# EAGLE design lab2_task1 (EAGLE 6.5.0)
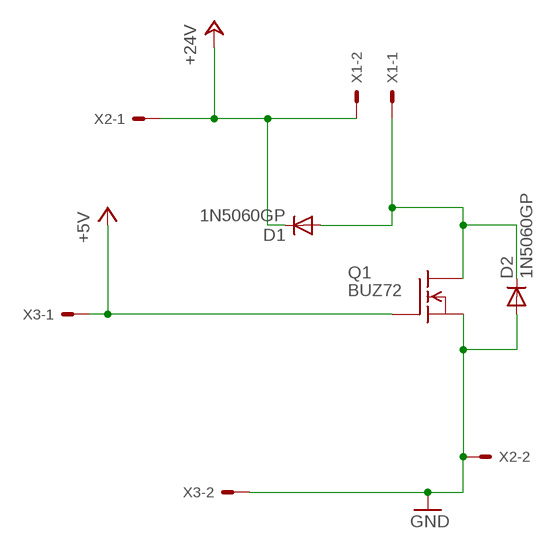
[diagram p0: schematic, sheet 1]

## Parts
D1  1N5060GP  [DO15-12]
D2  1N5060GP  [DO15-12]
Q1  BUZ72  [TO220]
X1  KK-156-2  [KK-156-2]
X2  KK-156-2  [KK-156-2]
X3  KK-156-2  [KK-156-2]

## Nets
+5V: Q1.1(G) X3.1
+24V: D1.C X1.2 X2.1
GND: D2.A Q1.3(S) X2.2 X3.2
N$1: D1.A D2.C Q1.2(D) X1.1

## Library data of the parts
D1 D2 = diode:1N5060GP: DIODE controlled avalanche rectifier
Q1 = transistor-fet:BUZ72: N-Channel Enhancement MOSFET 100V; 10A; 0,2Ohm
X1-X3 = con-molex:KK-156-2: KK 156 HEADER Source: http://www.molex.com/pdm_docs/sd/026604100_sd.pdf; OC_FARNELL: unknown; OC_NEWARK: unknown

## Board
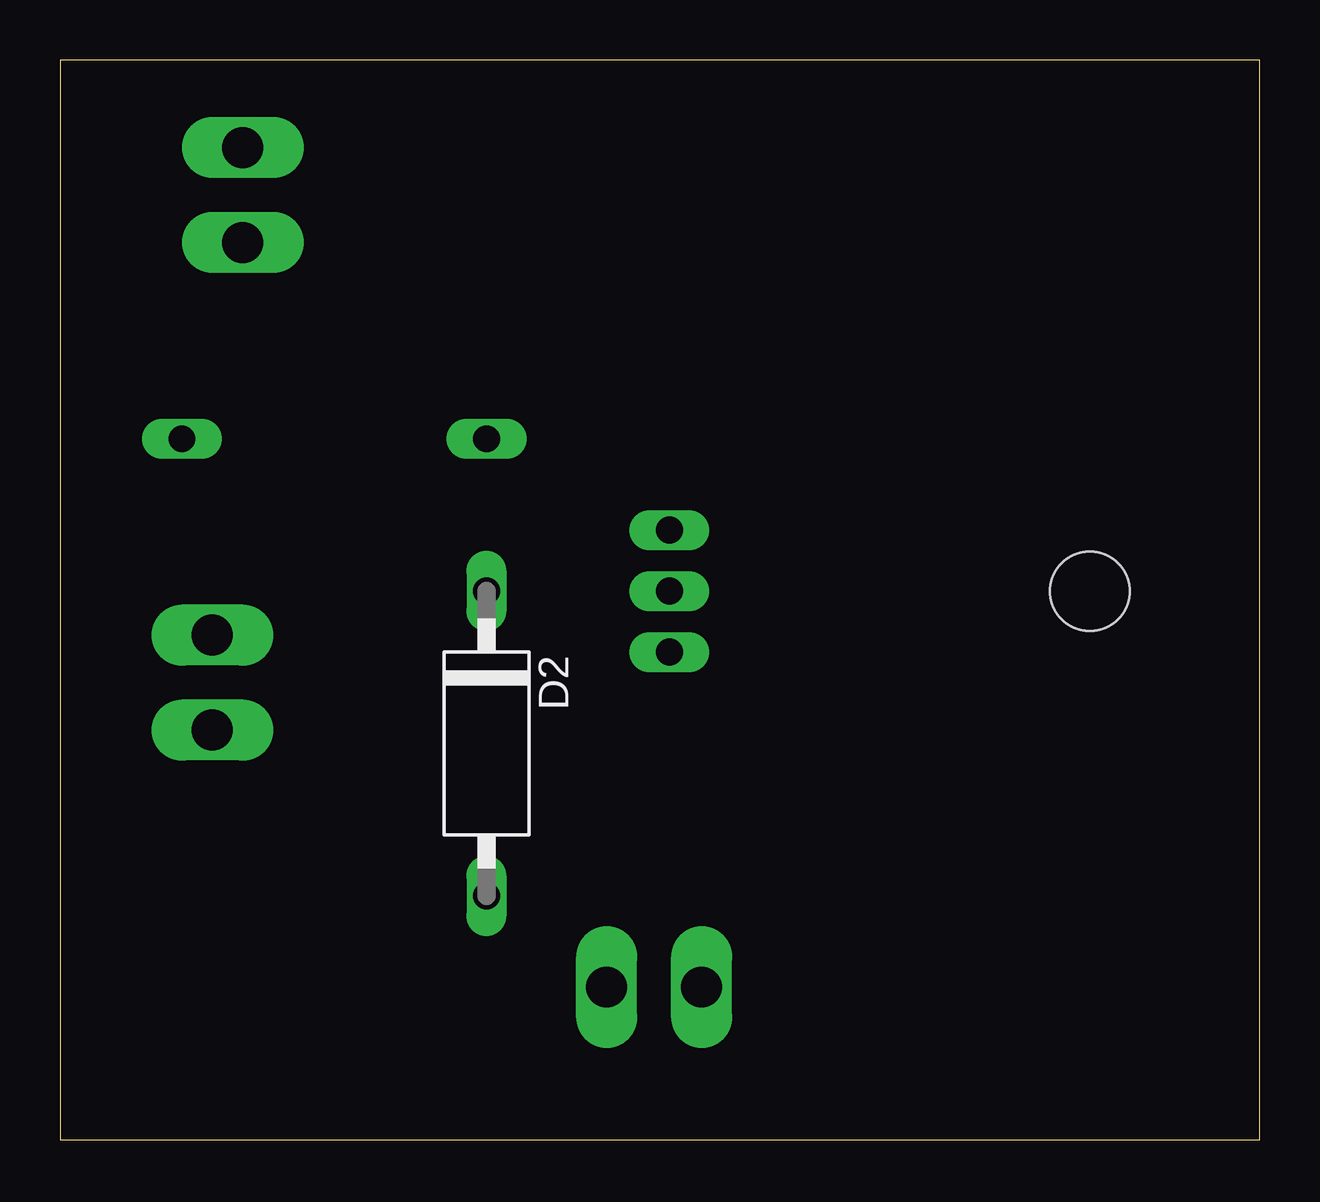
[diagram p1: board, top side]
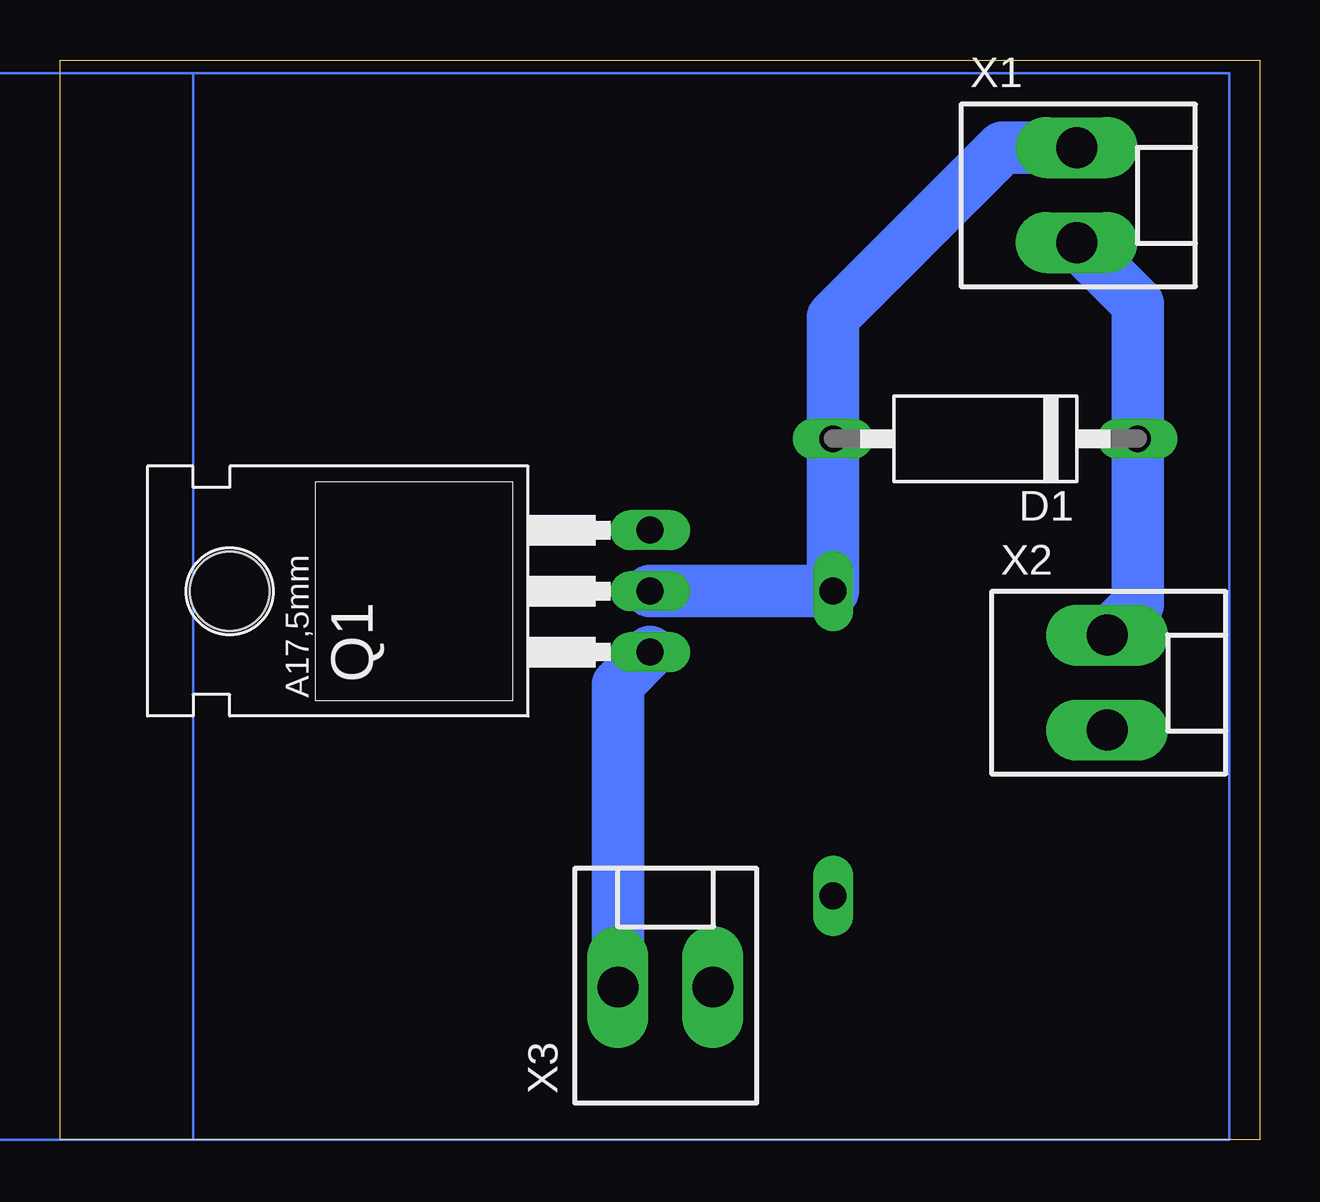
[diagram p2: board, bottom side, seen from below]

Size 50 x 45 mm. Coordinates in mm from the lower left corner, seen from the top.
Outline: 0,0 50,0 50,45 0,45 0,0
Copper layers (1*16): Top 0.035mm / dielectric 1.5mm / Bottom 0.035mm
Design rules "default": minimum track width 10mil, minimum drill 24mil, track to track 8mil, track to pad 8mil, pad to pad 8mil, via to via 8mil, smd to smd 8mil, copper to edge 40mil, drill to drill 8mil, minimum pad ring 10mil, minimum via ring 8mil, stop-mask expansion 4mil, vias tented up to drill 0mil, thermal gap 10mil

### Footprints (pad centres in the part's own frame; a part is rotated, then mirrored left to right if it is on the bottom)
DO15-12 = drill 1.118 long: A 6.35,0; C -6.35,0
TO220 = drill 1.118 long: 1 -2.54,-6.35; 2 0,-6.35; 3 2.54,-6.35 | hole 3.302: 0,11.176
KK-156-2 = drill 1.7 pad 2.184 long: 1 -1.98,0; 2 1.98,0

### Placement (x,y rotation side)
D1  11.43,29.21 180 bottom
D2  17.78,16.51 270 top
Q1  31.75,22.86 90 bottom
X1  7.62,39.37 270 bottom
X2  6.35,19.05 270 bottom
X3  24.77,6.35 0 bottom

### Tracks (layer width: path | path; a pad name or v marks a point on that pad's centre or on a via)
+5V
  Bottom 2.184: Q1.1 26.75,18.98 X3.1
+24V
  Bottom 2.184: X1.2 5.08,34.85 D1.C 5.08,22.3 X2.1
N$1
  Bottom 2.184: X1.1 10.72,41.35 17.78,34.29 D1.A D2.C Q1.2
(copper drawn outside any net)
  shapes: Bottom area x2